# Altium schematic sheet J1850_Tacho.SchDoc
size A4
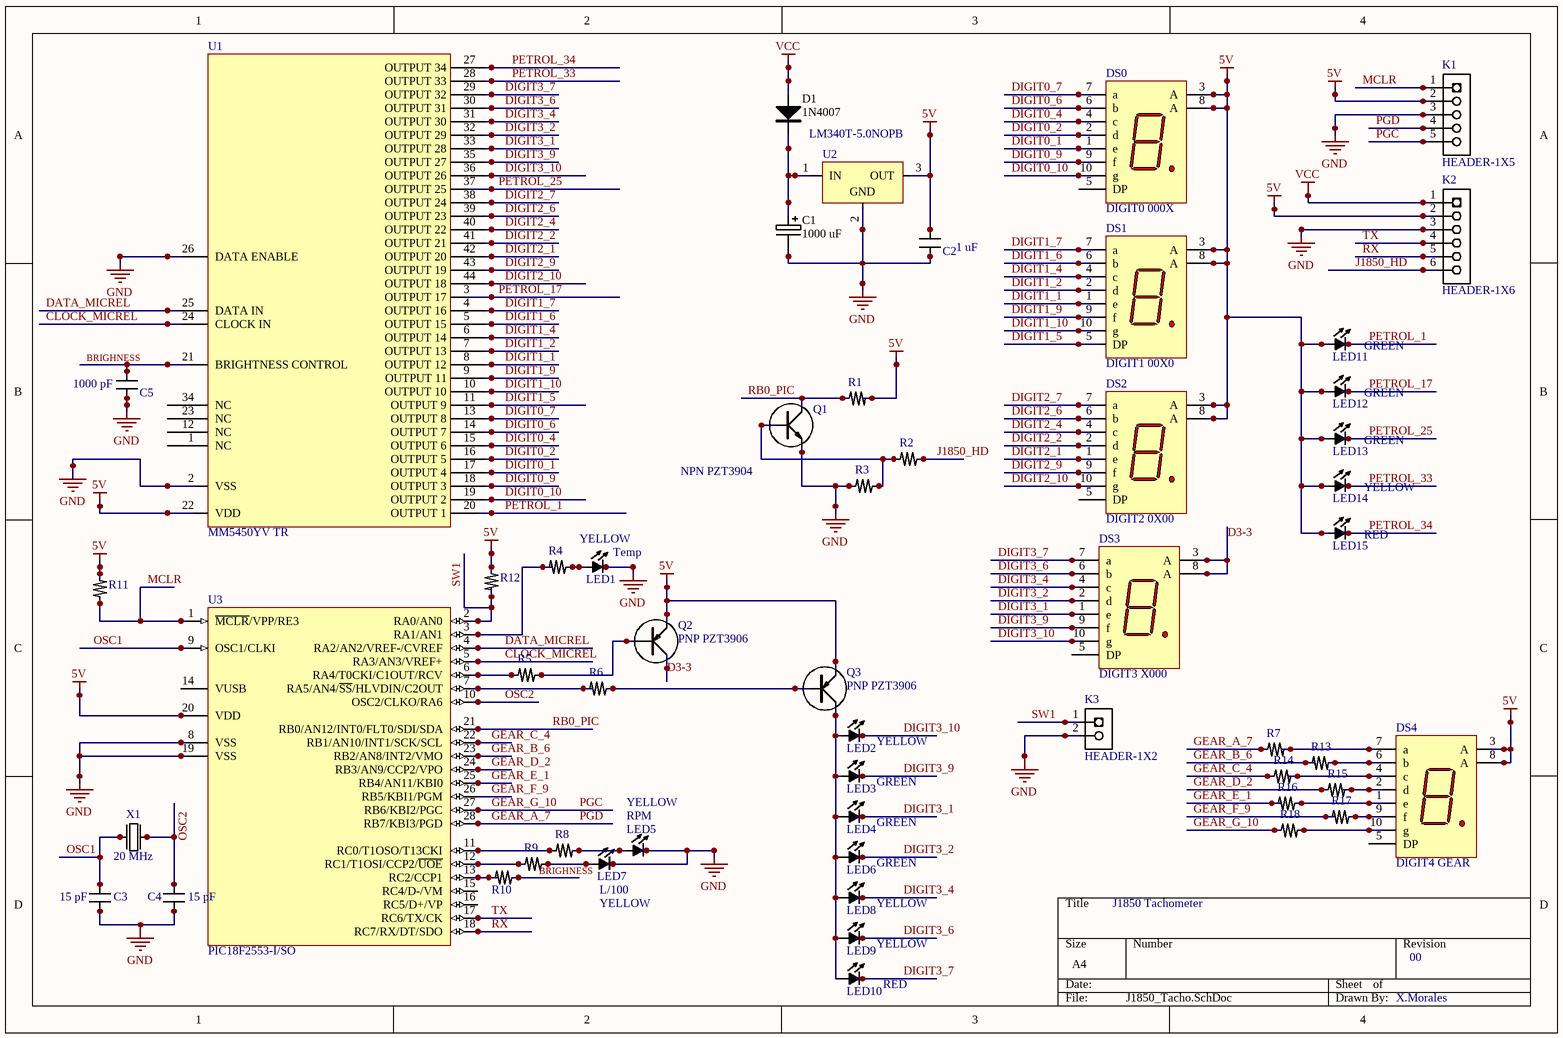
[diagram p0: J1850_Tacho.SchDoc]

## Parts
C1  1000 uF  [AXIAL CAP]
C2  1 uF  [C_0805]
C3  15 pF  [C_0805]
C4  15 pF  [C_0805]
C5  1000 pF  [C_0805]
D1  1N4007  [1N400X]
DS0  SA56-51ZGWA  [H-10]  (value not drawn)
DS1  SA56-51ZGWA  [H-10]  (value not drawn)
DS2  SA56-51ZGWA  [H-10]  (value not drawn)
DS3  SA56-51ZGWA  [H-10]  (value not drawn)
DS4  SA56-51ZGWA  [H-10]  (value not drawn)
K1  HEADER-1X5  [HEADER-1X5]
K2  HEADER-1X6  [HEADER-1X6]
K3  HEADER-1X2  [HEADER-1X2]
LED1  YELLOW  [LED_0805]
LED2  YELLOW  [LED_0805]
LED3  GREEN  [LED_0805]
LED4  GREEN  [LED_0805]
LED5  YELLOW  [LED_0805]
LED6  GREEN  [LED_0805]
LED7  YELLOW  [LED_0805]
LED8  YELLOW  [LED_0805]
LED9  YELLOW  [LED_0805]
LED10  RED  [LED_0805]
LED11  GREEN  [LED_0805]
LED12  GREEN  [LED_0805]
LED13  GREEN  [LED_0805]
LED14  YELLOW  [LED_0805]
LED15  RED  [LED_0805]
Q1  NPN PZT3904  [SOT223]
Q2  PNP PZT3906  [SOT223]
Q3  PNP PZT3906  [SOT223]
R1  47 kOhm  [R_0805]  (value not drawn)
R2  47 kOhm  [R_0805]  (value not drawn)
R3  10 kOhm  [R_0805]  (value not drawn)
R4  220 Ohm  [R_0805]  (value not drawn)
R5  1 kOhm  [R_0805]  (value not drawn)
R6  1 kOhm  [R_0805]  (value not drawn)
R7  220 Ohm  [R_0805]  (value not drawn)
R8  220 Ohm  [R_0805]  (value not drawn)
R9  220 Ohm  [R_0805]  (value not drawn)
R10  1200 Ohm  [R_0805]  (value not drawn)
R11  10 kOhm  [R_0805]  (value not drawn)
R12  10 kOhm  [R_0805]  (value not drawn)
R13  220 Ohm  [R_0805]  (value not drawn)
R14  220 Ohm  [R_0805]  (value not drawn)
R15  220 Ohm  [R_0805]  (value not drawn)
R16  220 Ohm  [R_0805]  (value not drawn)
R17  220 Ohm  [R_0805]  (value not drawn)
R18  220 Ohm  [R_0805]  (value not drawn)
U1  MM5450YV TR  [PLCC-L44_M]
U2  LM340T-5.0NOPB  [TO-220-3]
U3  PIC18F2553-I/SO  [SOIC-SO28_M]
X1  20 MHz  [XTAL - HC-49U]

## Nets
5V: C2.2 DS0.3(A) DS0.8(A) DS1.3(A) DS1.8(A) DS2.3(A) DS2.8(A) DS4.3(A) DS4.8(A) K1.2 K2.2 LED11.2 LED12.2 LED13.2 LED14.2 LED15.2 Q2.E Q3.E R1.1 R11.2 R12.2 U1.22(VDD) U2.3(OUT) U3.20(VDD)
GND: C1.2(-) C2.1 C3.1 C4.1 C5.1 K1.3 K2.3 K3.2 LED1.1 LED5.1 LED7.1 Q1.E R3.2 U1.2(VSS) U1.26(DATA_ENABLE) U2.2(GND) U3.8(VSS) U3.19(VSS)
VCC: D1.A K2.1
BRIGHNESS: C5.2 R10.1 U1.21(BRIGHTNESS_CONTROL)
CLOCK_MICREL: U1.24(CLOCK_IN) U3.5(RA3/AN3/VREF+)
D3-3: DS3.3(A) DS3.8(A) Q2.C
DATA_MICREL: U1.25(DATA_IN) U3.4(RA2/AN2/VREF-/CVREF)
DIGIT0_1: DS0.1(e) U1.17(OUTPUT_4)
DIGIT0_2: DS0.2(d) U1.16(OUTPUT_5)
DIGIT0_4: DS0.4(c) U1.15(OUTPUT_6)
DIGIT0_6: DS0.6(b) U1.14(OUTPUT_7)
DIGIT0_7: DS0.7(a) U1.13(OUTPUT_8)
DIGIT0_9: DS0.9(f) U1.18(OUTPUT_3)
DIGIT0_10: DS0.10(g) U1.19(OUTPUT_2)
DIGIT1_1: DS1.1(e) U1.8(OUTPUT_12)
DIGIT1_2: DS1.2(d) U1.7(OUTPUT_13)
DIGIT1_4: DS1.4(c) U1.6(OUTPUT_14)
DIGIT1_5: DS1.5(DP) U1.11(OUTPUT_9)
DIGIT1_6: DS1.6(b) U1.5(OUTPUT_15)
DIGIT1_7: DS1.7(a) U1.4(OUTPUT_16)
DIGIT1_9: DS1.9(f) U1.9(OUTPUT_11)
DIGIT1_10: DS1.10(g) U1.10(OUTPUT_10)
DIGIT2_1: DS2.1(e) U1.42(OUTPUT_20)
DIGIT2_2: DS2.2(d) U1.41(OUTPUT_21)
DIGIT2_4: DS2.4(c) U1.40(OUTPUT_22)
DIGIT2_6: DS2.6(b) U1.39(OUTPUT_23)
DIGIT2_7: DS2.7(a) U1.38(OUTPUT_24)
DIGIT2_9: DS2.9(f) U1.43(OUTPUT_19)
DIGIT2_10: DS2.10(g) U1.44(OUTPUT_18)
DIGIT3_1: DS3.1(e) LED4.1 U1.33(OUTPUT_28)
DIGIT3_2: DS3.2(d) LED6.1 U1.32(OUTPUT_29)
DIGIT3_4: DS3.4(c) LED8.1 U1.31(OUTPUT_30)
DIGIT3_6: DS3.6(b) LED9.1 U1.30(OUTPUT_31)
DIGIT3_7: DS3.7(a) LED10.1 U1.29(OUTPUT_32)
DIGIT3_9: DS3.9(f) LED3.1 U1.35(OUTPUT_27)
DIGIT3_10: DS3.10(g) LED2.1 U1.36(OUTPUT_26)
GEAR_A_7: K1.4 R7.2 U3.28(RB7/KBI3/PGD)  [also labelled PGD]
GEAR_B_6: R13.2 U3.23(RB2/AN8/INT2/VMO)
GEAR_C_4: R14.2 U3.22(RB1/AN10/INT1/SCK/SCL)
GEAR_D_2: R15.2 U3.24(RB3/AN9/CCP2/VPO)
GEAR_E_1: R16.2 U3.25(RB4/AN11/KBI0)
GEAR_F_9: R17.2 U3.26(RB5/KBI1/PGM)
GEAR_G_10: K1.5 R18.2 U3.27(RB6/KBI2/PGC)  [also labelled PGC]
J1850_HD: K2.6 R2.1
MCLR: K1.1 R11.1 U3.1(~{MCLR}/VPP/RE3)
OSC1: C3.2 U3.9(OSC1/CLKI) X1.1
OSC2: C4.2 U3.10(OSC2/CLKO/RA6) X1.2
PETROL_1: LED11.1 U1.20(OUTPUT_1)
PETROL_17: LED12.1 U1.3(OUTPUT_17)
PETROL_25: LED13.1 U1.37(OUTPUT_25)
PETROL_33: LED14.1 U1.28(OUTPUT_33)
PETROL_34: LED15.1 U1.27(OUTPUT_34)
RB0_PIC: Q1.C R1.2 U3.21(RB0/AN12/INT0/FLT0/SDI/SDA)
RX: K2.5 U3.18(RC7/RX/DT/SDO)
SW1: K3.1 R12.1 U3.2(RA0/AN0)
TX: K2.4 U3.17(RC6/TX/CK)
NetC1_1: C1.1(+) D1.K U2.1(IN)
NetDS4_1: DS4.1(e) R16.1
NetDS4_2: DS4.2(d) R15.1
NetDS4_4: DS4.4(c) R14.1
NetDS4_6: DS4.6(b) R13.1
NetDS4_7: DS4.7(a) R7.1
NetDS4_9: DS4.9(f) R17.1
NetDS4_10: DS4.10(g) R18.1
NetLED1_2: LED1.2 R4.1
NetLED2_2: LED2.2 LED3.2 LED4.2 LED6.2 LED8.2 LED9.2 LED10.2 Q3.C
NetLED5_2: LED5.2 R8.1
NetLED7_2: LED7.2 R9.1
NetQ1_B: Q1.B R2.2 R3.1
NetQ2_B: Q2.B R5.1
NetQ3_B: Q3.B R6.1
NetR4_2: R4.2 U3.3(RA1/AN1)
NetR5_2: R5.2 U3.6(RA4/T0CKI/C1OUT/RCV)
NetR6_2: R6.2 U3.7(RA5/AN4/~{SS}/HLVDIN/C2OUT)
NetR8_2: R8.2 U3.11(RC0/T1OSO/T13CKI)
NetR9_2: R9.2 U3.12(RC1/T1OSI/CCP2/~{UOE})
NetR10_2: R10.2 U3.13(RC2/CCP1)

Not connected (* = marked no-connect by the designer): DS0 5(DP); DS2 5(DP); DS3 5(DP); DS4 5(DP); U1 1(NC) 12(NC) 23(NC) 34(NC); U3 14(VUSB) 15(RC4/D-/VM) 16(RC5/D+/VP)

## Notes on the sheet
- (near DS0) DIGIT0 000X
- (near DS1) DIGIT1 00X0
- (near DS2) DIGIT2 0X00
- (near LED1) Temp
- (near DS3) DIGIT3 X000
- (near LED5) RPM
- L/100
- J1850 Tachometer
- (near DS4) DIGIT4 GEAR
- 00
- X.Morales

## Library data of the parts
C1 = AXIAL CAP: AXIAL CAPACITOR
C2-C5 = Capacitor SMD 0805: Value: 100pF; Published: 8-Jun-2000; LatestRevisionDate: 17-Jul-2002; LatestRevisionNote: Re-released for DXP Platform.; PackageReference: RAD-0.3; Publisher: Altium Limited
D1 = 1N4001
DS0 = 7Segment: 14.22 mm Low Current HER 7-Segment Display: CA, RH DP; 1 Alternative Part# (not high lum): 604-SA56-11GWA; Note: Pins 3 and 8 are redundant Anodes.; Lum Intensity: 188000; 0 Main Part#: SA56-51ZGWA
DS1-DS4 = HDSP-5551: 14.22 mm Low Current HER 7-Segment Display: CA, RH DP; LuminousIntensity: 200 ucd (Minimum).; LED_Colour: High Efficiency Red (HER); Note: Pins 3 and 8 are redundant Anodes.; Published: 26-May-2004; LatestRevisionDate: 11-Oct-2004; LatestRevisionNote: Display outline superimposed on PCB Footprint.; DatasheetDocument: 11-Mar-2003; PackageDocument: 24-Sep-2002; PackageReference: H-10; Publisher: Altium Limited; ComponentLink1Description: Manufacturer Link; ComponentLink1URL: http://www.agilent.com/; ComponentLink2Description: Datasheet; ComponentLink2URL: http://cp.literature.agilent.com/litweb/pdf/5989-2824EN.pdf
K1 = HEADER-1X5: PINHEADER 1X5; REEL: TH; Supplier 1: Digi-Key; Supplier Part Number 1: S1011E-36-ND
K3 = HEADER-1X2: REEL: TH; Supplier 1: Digi-Key; Supplier Part Number 1: S1011E-36-ND
LED1-LED15 = LED SMD 0805
Q1 = NPN TRANSISTOR
Q2 Q3 = PNP TRANSISTOR
R1-R18 = Resistor SMD 0805
U1 = MM5450YV TR: IC DRIVER DISPLAY LED 44PLCC; 576-1342-1-ND: Digikey Part Number; Manufacturer Part Number: MM5450YV TR
U2 = LM340T-5.0NOPB: IC REG LDO  5V 1A TO220-3; Manufacturer Part Number: LM340T-5.0/NOPB; DigiKey Part Number: LM340T-5.0/NOPB-ND; Package: TO220-3
U3 = PIC18F2553-I/SO: High Performance, Enhanced Flash, USB Microcontroller with 12-Bit A/D and nanoWatt Technology, 32K Flash, 28-Pin SOIC, Industrial Temperature Range; Published: 29-Jan-2009; LatestRevisionDate: 02-Dec-2009; LatestRevisionNote: Updated to datasheet revision C, Oct-2009; DatasheetVersion: revC, Oct-2009; PackageVersion: revBB, Aug-2009; PackageReference: SOIC-SO28; Publisher: Altium Limited; PackageDescription: 28-Lead Plastic Small Outline (SO) - Wide 7.50mm Body [SOIC]; Supplier 1: Digi-Key; Supplier Part Number 1: PIC18F2553-I/SO-ND; Supplier 2: Farnell; Supplier Part Number 2: 1579602; Code_JEDEC: MS-013; ComponentLink1Description: Datasheet; ComponentLink1URL: http://ww1.microchip.com/downloads/en/DeviceDoc/39887c.pdf; ComponentLink2Description: Packaging Specification; ComponentLink2URL: http://www.microchip.com/stellent/groups/techpub_sg/documents/packagingspec/en012702.pdf; ComponentLink3Description: Microchip.com Home; ComponentLink3URL: http://www.microchip.com/
X1 = XTAL
K2 = HEADER-1X6: Supplier 1: Digi-Key; Supplier Part Number 1: S1011E-36-ND